# Altium schematic sheet 08 ETHERNET.SchDoc
size 513 x 386 mm
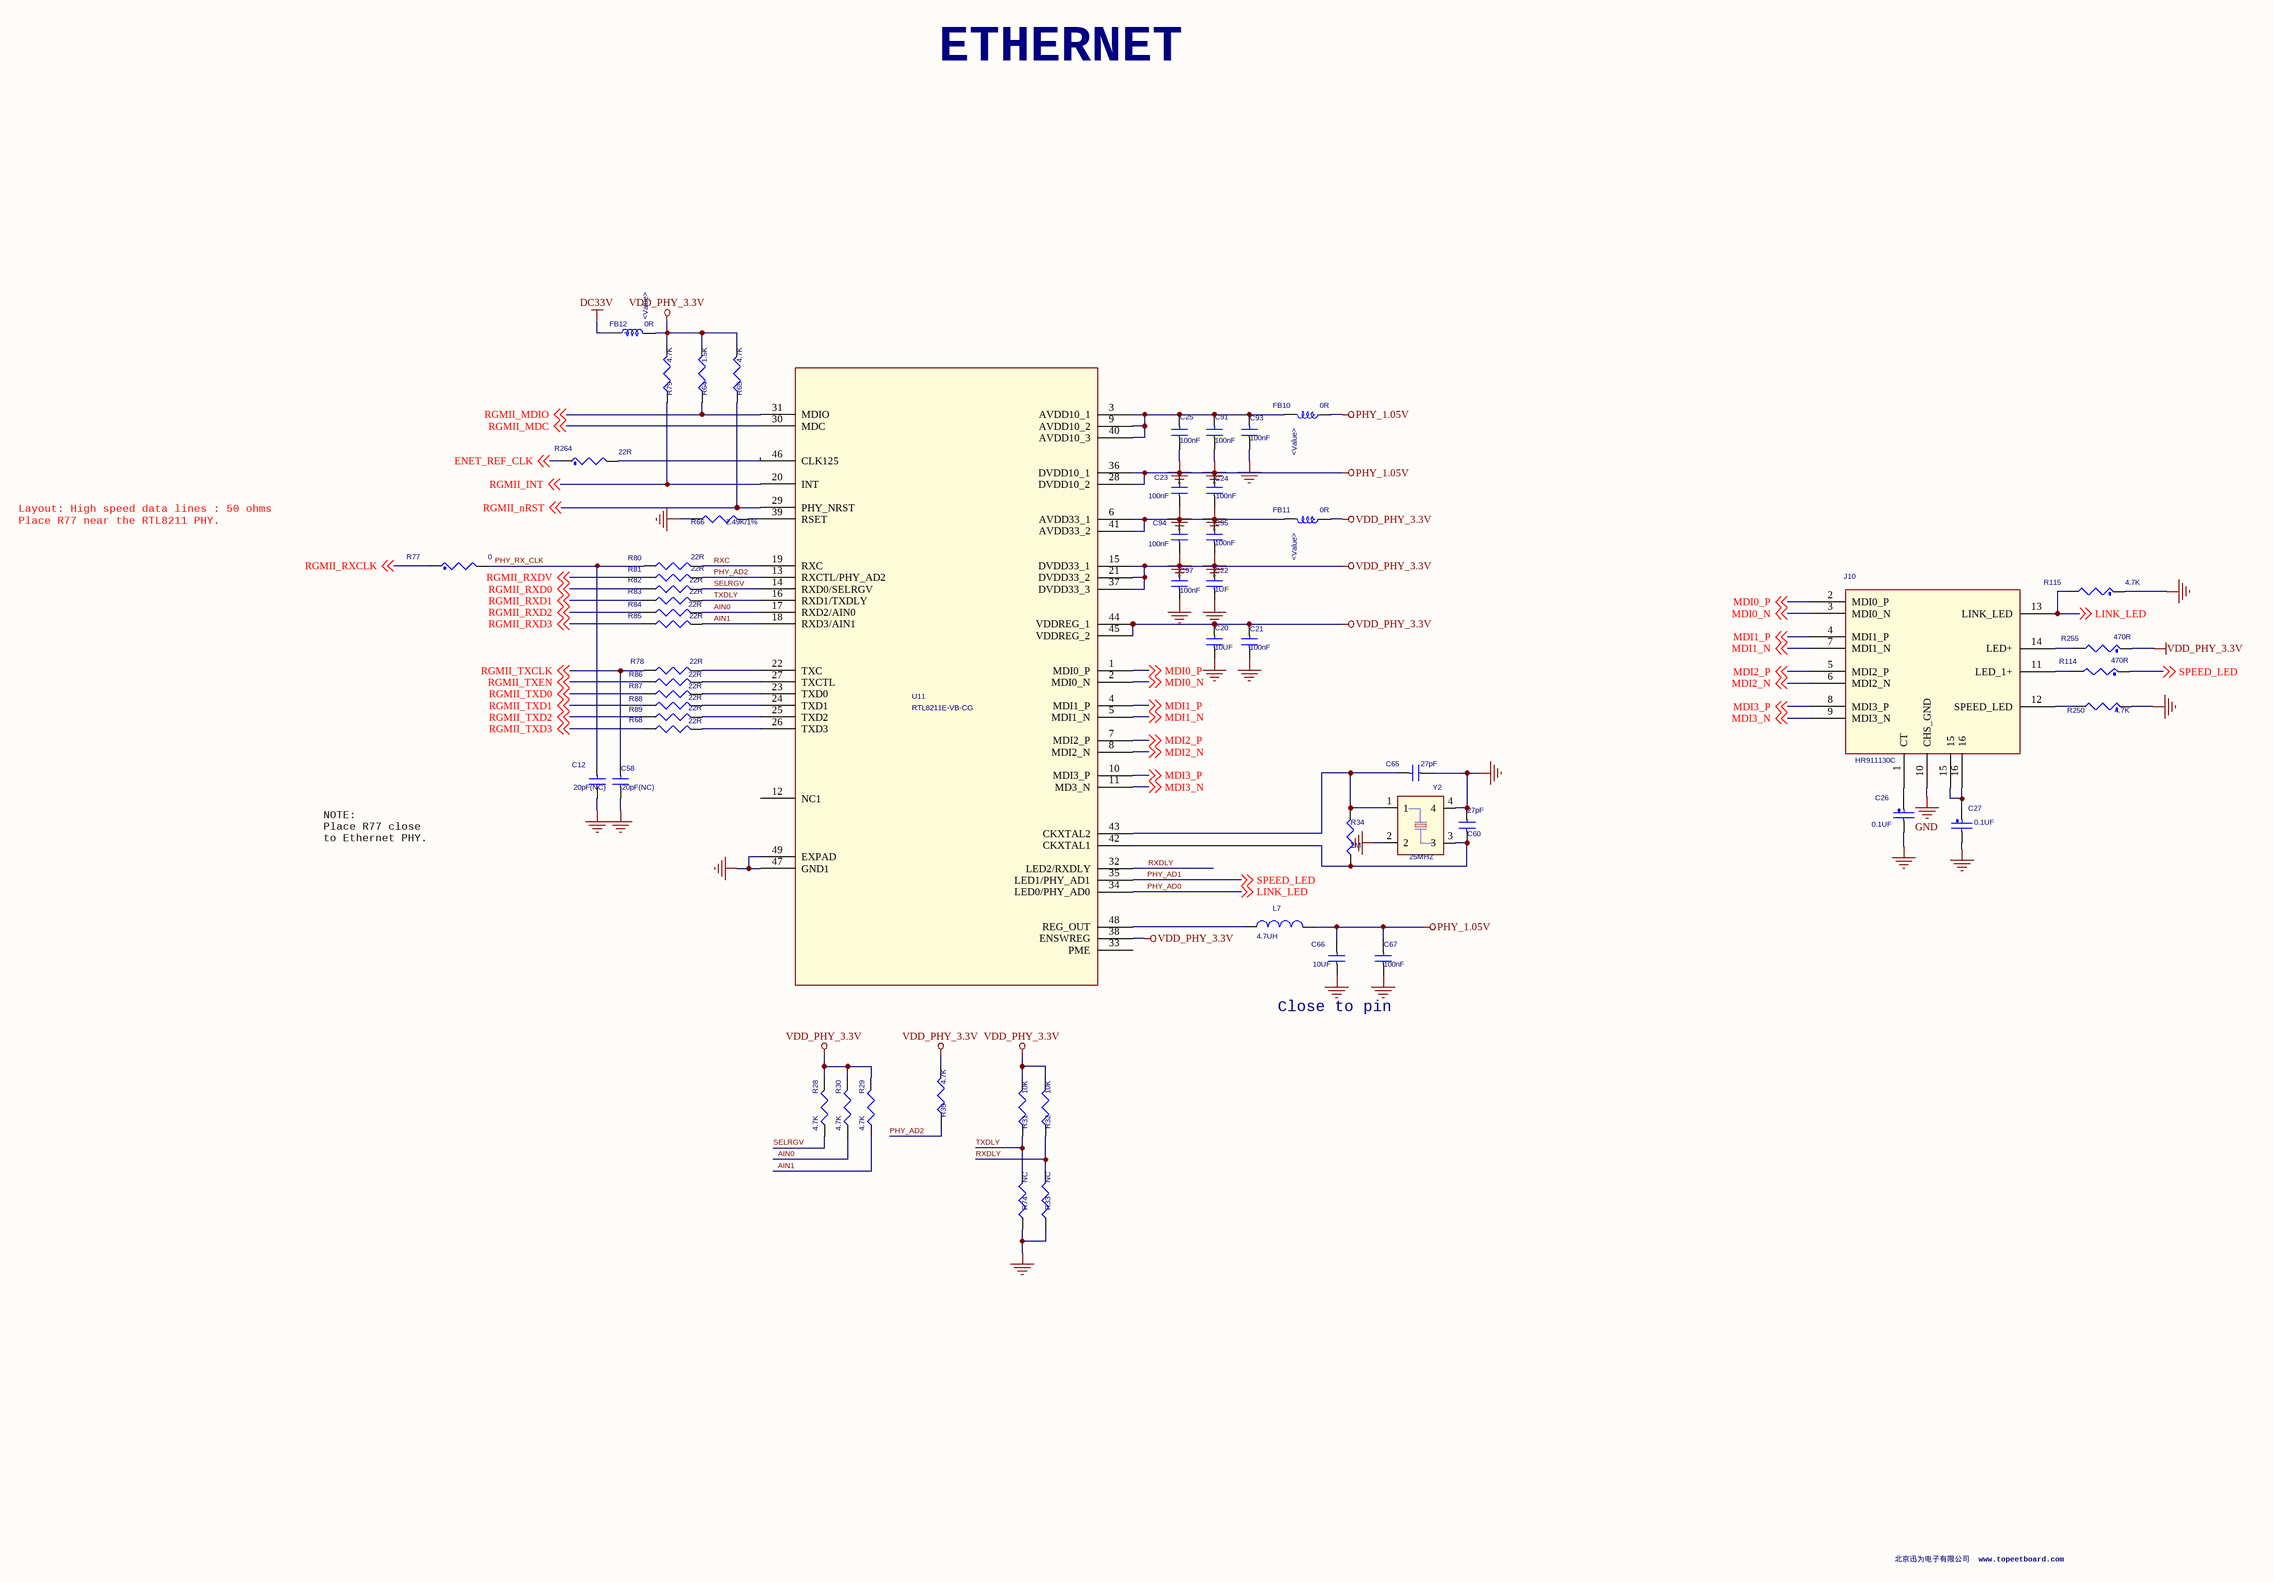
[diagram p0: 08 ETHERNET.SchDoc]

## Parts
C12  20pF(NC)  [C0402]
C20  10UF  [C0603]
C21  100nF  [C0603]
C22  1UF  [C0402]
C23  100nF  [C0402]
C24  100nF  [C0402]
C25  100nF  [C0402]
C26  0.1UF  [C0402]
C27  0.1UF  [C0402]
C58  20pF(NC)  [C0402]
C60  27pF  [C0402]
C65  27pF  [C0402]
C66  10UF  [C0603]
C67  100nF  [C0402]
C91  100nF  [C0402]
C93  100nF  [C0402]
C94  100nF  [C0402]
C95  100nF  [C0402]
C97  100nF  [C0402]
FB10  0R  5th Part Field: <Value>  [L0603]
FB11  0R  5th Part Field: <Value>  [L0603]
FB12  0R  5th Part Field: <Value>  [L0603]
J10  HR911130C  [RJ10-SRLBY]
L7  4.7UH  [IND2520]
R28  4.7K  [R0402]
R29  4.7K  [R0402]
R30  4.7K  [R0402]
R31  10K  [R0402]
R32  10K  [R0402]
R33  NC  [R0402]
R34  1M  [R0402]
R35  4.7K  [R0402]
R64  1.5K  [R0402]
R65  4.7K  [R0402]
R66  2.49K/1%  [R0402]
R68  22R  [R0402]
R74  NC  [R0402]
R77  0  [R0402]
R78  22R  [R0402]
R79  4.7K  [R0402]
R80  22R  [R0402]
R81  22R  [R0402]
R82  22R  [R0402]
R83  22R  [R0402]
R84  22R  [R0402]
R85  22R  [R0402]
R86  22R  [R0402]
R87  22R  [R0402]
R88  22R  [R0402]
R89  22R  [R0402]
R114  470R  [R0402]
R115  4.7K  [R0402]
R250  4.7K  [R0402]
R255  470R  [R0402]
R264  22R  [R0402]
U11  RTL8211E-VB-CG  [QFN48_0P4_6X6MM_EPAD]
Y2  25MHZ  [X4-2_5X3_2]

## Nets
DC33V: FB12.1
GND: C12.1 C20.1 C21.1 C22.1 C23.1 C24.1 C25.1 C26.2 C27.2 C58.1 C60.1 C65.1 C66.1 C67.1 C91.1 C93.1 C94.1 C95.1 C97.1 J10.10(CHS_GND) R33.1 R66.1 R74.1 R115.1 R250.1 U11.47(GND1) U11.49(EXPAD) Y2.2 Y2.4
PHY_1.05V: C23.2 C24.2 C66.2 C67.2 FB10.1 L7.2 U11.28(DVDD10_2) U11.36(DVDD10_1)
VDD_PHY_3.3V: C20.2 C21.2 C22.2 C97.2 FB11.1 FB12.2 R28.2 R29.2 R30.2 R31.2 R32.2 R35.2 R64.2 R65.2 R79.2 R255.1 U11.15(DVDD33_1) U11.21(DVDD33_2) U11.37(DVDD33_3) U11.38(ENSWREG) U11.44(VDDREG_1) U11.45(VDDREG_2)
AIN0: R30.1 R84.2 U11.17(RXD2/AIN0)
AIN1: R29.1 R85.2 U11.18(RXD3/AIN1)
ENET_REF_CLK: R264.1 ; off-sheet ENET_REF_CLK
MDI0_N: J10.3(MDI0_N) U11.2(MDI0_N) ; off-sheet MDI0_N
MDI0_P: J10.2(MDI0_P) U11.1(MDI0_P) ; off-sheet MDI0_P
MDI1_N: J10.7(MDI1_N) U11.5(MDI1_N) ; off-sheet MDI1_N
MDI1_P: J10.4(MDI1_P) U11.4(MDI1_P) ; off-sheet MDI1_P
MDI2_N: J10.6(MDI2_N) U11.8(MDI2_N) ; off-sheet MDI2_N
MDI2_P: J10.5(MDI2_P) U11.7(MDI2_P) ; off-sheet MDI2_P
MDI3_N: J10.9(MDI3_N) U11.11(MD3_N) ; off-sheet MDI3_N
MDI3_P: J10.8(MDI3_P) U11.10(MDI3_P) ; off-sheet MDI3_P
PHY_AD0: J10.13(LINK_LED) R115.2 U11.34(LED0/PHY_AD0) ; off-sheet LINK_LED  [also labelled LINK_LED]
PHY_AD1: R114.1 U11.35(LED1/PHY_AD1) ; off-sheet SPEED_LED  [also labelled SPEED_LED]
PHY_AD2: R35.1 R81.2 U11.13(RXCTL/PHY_AD2)
PHY_RX_CLK: C12.2 R77.2 R80.1
RGMII_INT: R79.1 U11.20(INT) ; off-sheet RGMII_INT
RGMII_MDC: U11.30(MDC) ; off-sheet RGMII_MDC
RGMII_MDIO: R64.1 U11.31(MDIO) ; off-sheet RGMII_MDIO
RGMII_nRST: R65.1 U11.29(PHY_NRST) ; off-sheet RGMII_nRST
RGMII_RXCLK: R77.1 ; off-sheet RGMII_RXCLK
RGMII_RXD0: R82.1 ; off-sheet RGMII_RXD0
RGMII_RXD1: R83.1 ; off-sheet RGMII_RXD1
RGMII_RXD2: R84.1 ; off-sheet RGMII_RXD2
RGMII_RXD3: R85.1 ; off-sheet RGMII_RXD3
RGMII_RXDV: R81.1 ; off-sheet RGMII_RXDV
RGMII_TXCLK: C58.2 R78.1 ; off-sheet RGMII_TXCLK
RGMII_TXD0: R87.1 ; off-sheet RGMII_TXD0
RGMII_TXD1: R88.1 ; off-sheet RGMII_TXD1
RGMII_TXD2: R89.1 ; off-sheet RGMII_TXD2
RGMII_TXD3: R68.1 ; off-sheet RGMII_TXD3
RGMII_TXEN: R86.1 ; off-sheet RGMII_TXEN
RXC: R80.2 U11.19(RXC)
RXDLY: R32.1 R33.2 U11.32(LED2/RXDLY)
SELRGV: R28.1 R82.2 U11.14(RXD0/SELRGV)
TXDLY: R31.1 R74.2 R83.2 U11.16(RXD1/TXDLY)
NetC25_2: C25.2 C91.2 C93.2 FB10.2 U11.3(AVDD10_1) U11.9(AVDD10_2) U11.40(AVDD10_3)
NetC26_1: C26.1 J10.1(CT)
NetC27_1: C27.1 J10.15 J10.16
NetC60_2: C60.2 R34.1 U11.42(CKXTAL1) Y2.3
NetC65_2: C65.2 R34.2 U11.43(CKXTAL2) Y2.1
NetC94_2: C94.2 C95.2 FB11.2 U11.6(AVDD33_1) U11.41(AVDD33_2)
NetJ10_11: J10.11(LED_1+) R114.2
NetJ10_12: J10.12(SPEED_LED) R250.2
NetJ10_14: J10.14(LED+) R255.2
NetL7_1: L7.1 U11.48(REG_OUT)
NetR66_2: R66.2 U11.39(RSET)
NetR68_2: R68.2 U11.26(TXD3)
NetR78_2: R78.2 U11.22(TXC)
NetR86_2: R86.2 U11.27(TXCTL)
NetR87_2: R87.2 U11.23(TXD0)
NetR88_2: R88.2 U11.24(TXD1)
NetR89_2: R89.2 U11.25(TXD2)
NetR264_2: R264.2 U11.46(CLK125)

Not connected (* = marked no-connect by the designer): U11 12(NC1) 33(PME)

## Notes on the sheet
- ETHERNET
- Layout: High speed data lines : 50 ohms
  Place R77 near the RTL8211 PHY.
- NOTE:
  Place R77 close
  to Ethernet PHY.
- Close to pin
- 北京迅为电子有限公司  www.topeetboard.com

## Library data of the parts
C12 C20-C25 C58 C60 C65-C67 C91 C93-C95 C97 = CAP
C26 = CAP_NP: CAP CER 0.1UF 16V 10% X7R 0402; ROOM: RGMII_PHY; FPLIST: CC0402_25,CC0402_HD,0402_CC; CAD_APPROVED: Yes; ASSY_OPT: DNP; MFG_PN01: C0402C104K4RAC; MFG_NAME01: KEMET; AGILE_PN: 150-75182; PRIORITY_PN: 021-00196; SIGNAL_MODEL: DEFAULT_CAPACITOR_100000pF_2_1; WVDC: 16V; TOL: 10%; HEIGHT: 0.635MM; ROHS: Yes; Tolerance: 10%; VOLTAGE: 16V
C27 = CAP_NP: CAP CER 0.1UF 16V 10% X7R 0402; SIGNAL_MODEL: DEFAULT_CAPACITOR_100000pF_2_1; PRIORITY_PN: 021-00196; AGILE_PN: 150-75182; MFG_NAME01: KEMET; MFG_PN01: C0402C104K4RAC; ASSY_OPT: DNP; CAD_APPROVED: Yes; FPLIST: CC0402_25,CC0402_HD,0402_CC; ROOM: RGMII_PHY; VOLTAGE: 16V; Tolerance: 10%; ROHS: Yes; HEIGHT: 0.635MM; TOL: 10%; WVDC: 16V
FB10-FB12 = IND_EMI: Inductor,0402，10ohm@100M,; 4th Part Field: TDK; Manufacturer Part Number: BLM15AG100SN1; Manufacturer: Murata; 7th Part Field: Inductor,; Height: 0.5; Temperature: -55 - +125; Part Number: BLM15AG100SN1
J10 = HR911130C_0
L7 = INDUCTOR
R28-R35 R64-R66 R68 R74 R78-R89 = RES
R77 R264 = RES_Dup1: RES MF ZERO OHM 1/10W -- 0402; FPLIST: RC0402_25,RC0402_HD,RC0402_X2,0402_CC; CAD_APPROVED: Yes; MFG_PN01: ERJ-2GE0R00X; MFG_NAME01: Panasonic; AGILE_PN: 470-79965; SIGNAL_MODEL: DEFAULT_RESISTOR_0.001OHM_2_1; ROHS: Yes
R114 = RES_Dup1: RES MF 270 OHM 1/16W 5% 0402; AGILE_PN: 470-30332; MFG_NAME01: VISHAY INTERTECHNOLOGY; MFG_PN01: CRCW0402270RJNED; CAD_APPROVED: Yes; FPLIST: RC0402_25,RC0402_HD,0402_CC; SIGNAL_MODEL: DEFAULT_RESISTOR_270OHM_2_1; Tolerance: 5%; ROHS: Yes
R115 R250 R255 = RES_Dup1: RES MF 270 OHM 1/16W 5% 0402; SIGNAL_MODEL: DEFAULT_RESISTOR_270OHM_2_1; FPLIST: RC0402_25,RC0402_HD,0402_CC; CAD_APPROVED: Yes; MFG_PN01: CRCW0402270RJNED; MFG_NAME01: VISHAY INTERTECHNOLOGY; AGILE_PN: 470-30332; ROHS: Yes; Tolerance: 5%
U11 = RTL8211E-VB-GC
Y2 = Crystal-SMD4P